# Altium schematic sheet AUDIO_AMP_LM4849.SchDoc: AUDIO AMP & MIXER LM4849
size A4; Organization: Altium Limited.; Address1: Level 3, 12a Rodborough Rd; Address2: Frenchs Forest 2086; Address3: NSW; Address4: AUSTRALIA; Revision: 6; SheetNumber: 64; SheetTotal: 64; PageSetup: Record=PageOptions|CenterHorizontal=True|CenterVertical=True|PrintScale=0.97|XCorrection=1.00|YCorrection=1.00|PrintKind=0|BorderSize=5000000|LeftOffset=0|BottomOffset=0|Orientation=2|PaperLength=1000|PaperWidth=1000|Scale=100|PaperSource=7|PrintQuality=-4|MediaType=1|DitherType=10|PaperKind=A4 (210 x 297 mm)|PrintScaleMode=1
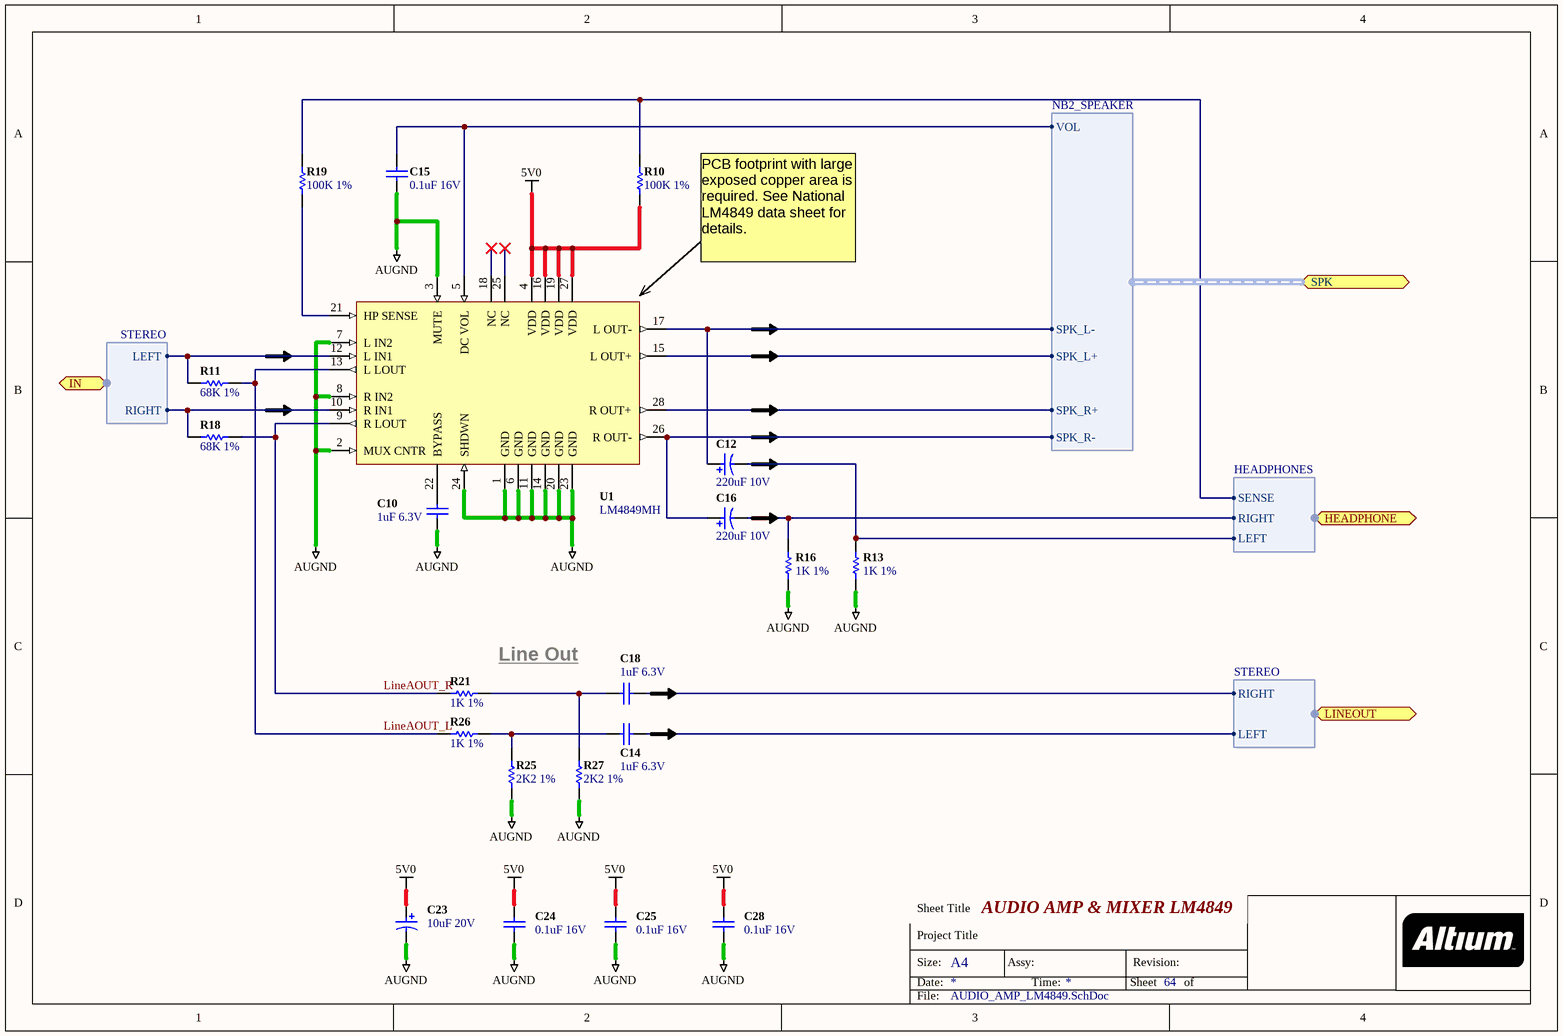
[diagram p0: AUDIO_AMP_LM4849.SchDoc]

## Parts
C10  1uF 6.3V  [CAPC1005-STAR]
C12  220uF 10V  [CAPC7343-STAR]
C14  1uF 6.3V  [CAPC1005-STAR]
C15  0.1uF 16V  [CAPC1005-STAR]
C16  220uF 10V  [CAPC7343-STAR]
C18  1uF 6.3V  [CAPC1005-STAR]
C23  10uF 20V  [CAPC3528-STAR]
C24  0.1uF 16V  [CAPC1005-STAR]
C25  0.1uF 16V  [CAPC1005-STAR]
C28  0.1uF 16V  [CAPC1005-STAR]
R10  100K 1%  [RESC1005-STAR]
R11  68K 1%  [RESC1005-STAR]
R13  1K 1%  [RESC1005-STAR]
R16  1K 1%  [RESC1005-STAR]
R18  68K 1%  [RESC1005-STAR]
R19  100K 1%  [RESC1005-STAR]
R21  1K 1%  [RESC1005-STAR]
R25  2K2 1%  [RESC1005-STAR]
R26  1K 1%  [RESC1005-STAR]
R27  2K2 1%  [RESC1005-STAR]
U1  LM4849MH  [TSOP65P640_HS-28]

## Ports
HEADPHONE (harness HEADPHONES), IN (harness STEREO), LINEOUT (harness STEREO), SPK (harness NB2_SPEAKER)

## Harnesses
NB2_SPEAKER: SPK_L-, SPK_L+, SPK_R-, SPK_R+, VOL
STEREO: RIGHT, LEFT
HEADPHONES: RIGHT, LEFT, SENSE

## Nets
5V0: C23.1 C24.2 C25.2 C28.2 R10.2 U1.4(VDD) U1.16(VDD) U1.19(VDD) U1.27(VDD)
AUGND: C10.2 C15.1 C23.2 C24.1 C25.1 C28.1 R13.1 R16.1 R25.1 R27.2 U1.1(GND) U1.2(MUX_CNTR) U1.3(MUTE) U1.6(GND) U1.7(L_IN2) U1.8(R_IN2) U1.11(GND) U1.14(GND) U1.20(GND) U1.23(GND) U1.24(SHDWN)
LineAOUT_L: R11.2 R26.1 U1.13(L_LOUT)
LineAOUT_R: R18.2 R21.1 U1.9(R_LOUT)
NetC10_1: C10.1 U1.22(BYPASS)
NetC12_1: C12.1 U1.17(L_OUT-) ; port SPK.SPK_L-
NetC12_2: C12.2 R13.2 ; port HEADPHONE.LEFT
NetC14_1: C14.1 R25.2 R26.2
NetC14_2: C14.2 ; port LINEOUT.LEFT
NetC15_2: C15.2 U1.5(DC_VOL) ; port SPK.VOL
NetC16_1: C16.1 U1.26(R_OUT-) ; port SPK.SPK_R-
NetC16_2: C16.2 R16.2 ; port HEADPHONE.RIGHT
NetC18_1: C18.1 ; port LINEOUT.RIGHT
NetC18_2: C18.2 R21.2 R27.1
NetR10_1: R10.1 R19.1 ; port HEADPHONE.SENSE
NetR11_1: R11.1 U1.12(L_IN1) ; port IN.LEFT
NetR18_1: R18.1 U1.10(R_IN1) ; port IN.RIGHT
NetR19_2: R19.2 U1.21(HP_SENSE)
NetU1_15: U1.15(L_OUT+) ; port SPK.SPK_L+
NetU1_28: U1.28(R_OUT+) ; port SPK.SPK_R+

Not connected (* = marked no-connect by the designer): U1 18(NC)* 25(NC)*

## Notes on the sheet
- PCB footprint with large exposed copper area is required. See National LM4849 data sheet for details.
- Line Out
- Sheet Title
- Project Title
- Size:
- Date:
- A4
- Assy:
- Time:
- Sheet
- Revision:
- of
- File:

## Library data of the parts
C10 C14 C18 = D-101-0082: Capacitor, Ceramic, 1uF 10% 6.3V 0402 (1005) X5R; Polarity: Non-Polarized; Category: Capacitor; Capacitance: 1 uF; Dielectric: X5R; Mounting Technology: Surface Mount; Rated Voltage: 6.3 V; Status: Unreleased; Technology: None; Tolerance: 10 %
C12 C16 = D-101-0088: Capacitor, Tantalum, 220uF 10% 10V MCCT-D (7343-31); Polarity: Polarized; Category: Capacitor; Capacitance: 220 uF; Mounting Technology: Surface Mount; Rated Voltage: 10 V; Status: Unreleased; Technology: Tantalum; Tolerance: 10 %
C15 C24 C25 C28 = D-101-0080: Capacitor, Ceramic, 0.1uF 10% 16V 0402 (1005) X7R; Polarity: Non-Polarized; Category: Capacitor; Capacitance: 0.1 uF; Dielectric: X7R; Mounting Technology: Surface Mount; Rated Voltage: 16 V; Status: Production; Technology: Ceramic; Tolerance: 10 %
C23 = D-101-0007: Capacitor, Tantalum, 10uF 10% 20V MCCT-B (3528); Polarity: Polarized; Category: Capacitor; Capacitance: 10 uF; Mounting Technology: Surface Mount; Rated Voltage: 20 V; Status: Production; Technology: Tantalum; Tolerance: 10 %
R10 R19 = D-100-0132: Resistor, 100K 1% 0402 (1005); Power Rating: 63 mW; Category: Resistor; Mounting Technology: Surface Mount; Resistance: 100 K; Status: Production; Tolerance: 1 %
R11 R18 = D-100-0081: Resistor, 68K 1% 0402 (1005); Power Rating: 63 mW; Category: Resistor; Mounting Technology: Surface Mount; Resistance: 68 K; Status: Production; Tolerance: 1 %
R13 R16 R21 R26 = D-100-0121: Resistor, 1K 1% 0402 (1005); Power Rating: 63 mW; Category: Resistor; Mounting Technology: Surface Mount; Resistance: 1 K; Status: Production; Tolerance: 1 %
R25 R27 = D-100-0107: Resistor, 2K2 1% 0402 (1005); Power Rating: 63 mW; Resistance: 2.2 K; Category: Resistor; Mounting Technology: Surface Mount; Status: Production; Tolerance: 1 %
U1 = D-201-0002: LM4849MH Stereo 2W Audio Power Amplifier with DC Volume Control and Input Mux; Category: IC-Audio; Status: Production